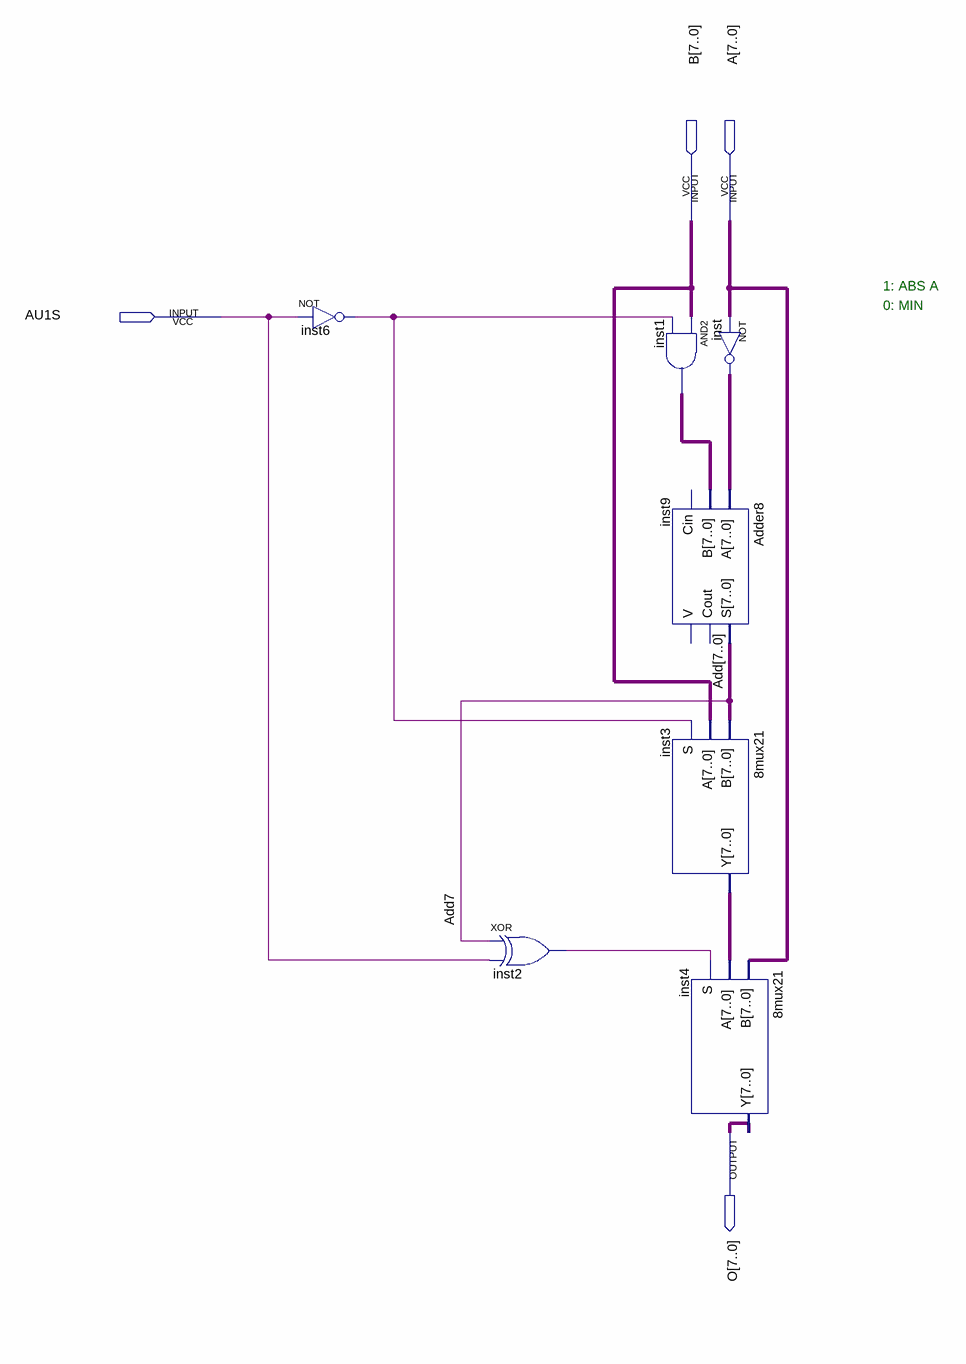
[diagram p0: schematic sheet]
// Quartus schematic AU1.bdf as structural Verilog: 7 symbols, 4 pins
module AU1 (
  input  [7:0] B,
  input  [7:0] A,
  input  AU1S,
  output [7:0] O
);

  wire inst2_out, inst6_out;
  wire [7:0] Add, inst1_out, inst3_y, inst_out;

  not inst6 (inst6_out, AU1S);
  xor inst2 (inst2_out, Add[7], AU1S);
  assign inst1_out = B & {8{inst6_out}};  // AND2 inst1, 8 bits wide
  Adder8 inst9 (.A(inst_out), .B(inst1_out), .S(Add));  // open: Cin, Cout, V
  \8mux21  inst3 (.A(B), .B(Add), .S(inst6_out), .Y(inst3_y));
  \8mux21  inst4 (.A(inst3_y), .B(A), .S(inst2_out), .Y(O));
  assign inst_out = ~A;  // NOT inst, 8 bits wide

  // Notes on the sheet:
  //   1: ABS A
  //   0: MIN
endmodule
